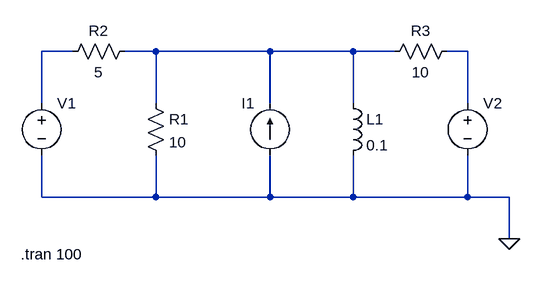
[diagram p0: schematic playdraf5.asc]
playdraf5.asc, the LTspice schematic file:
Version 4
SHEET 1 880 680
WIRE -80 96 -128 96
WIRE 48 96 0 96
WIRE 224 96 48 96
WIRE 352 96 224 96
WIRE 416 96 352 96
WIRE 528 96 496 96
WIRE -128 176 -128 96
WIRE 48 176 48 96
WIRE 224 176 224 96
WIRE 352 176 352 96
WIRE 528 176 528 96
WIRE -128 320 -128 256
WIRE 48 320 48 256
WIRE 48 320 -128 320
WIRE 224 320 224 256
WIRE 224 320 48 320
WIRE 352 320 352 256
WIRE 352 320 224 320
WIRE 528 320 528 256
WIRE 528 320 352 320
WIRE 592 320 528 320
WIRE 592 384 592 320
FLAG 592 384 0
SYMBOL ind 336 160 R0
SYMATTR InstName L1
SYMATTR Value 0.1
SYMBOL res 32 160 R0
SYMATTR InstName R1
SYMATTR Value 10
SYMBOL res 16 80 R90
WINDOW 0 0 56 VBottom 2
WINDOW 3 32 56 VTop 2
SYMATTR InstName R2
SYMATTR Value 5
SYMBOL res 512 80 R90
WINDOW 0 0 56 VBottom 2
WINDOW 3 32 56 VTop 2
SYMATTR InstName R3
SYMATTR Value 10
SYMBOL voltage -128 160 R0
WINDOW 3 24 96 Invisible 2
WINDOW 123 0 0 Left 0
WINDOW 39 0 0 Left 0
SYMATTR Value PULSE(0 1 20 1f 1f 200)
SYMATTR InstName V1
SYMBOL voltage 528 160 R0
WINDOW 3 24 96 Invisible 2
WINDOW 123 0 0 Left 0
WINDOW 39 0 0 Left 0
SYMATTR Value PULSE(0 2 20 1f 1f 200)
SYMATTR InstName V2
SYMBOL current 224 256 R180
WINDOW 0 24 80 Left 2
WINDOW 3 24 0 Invisible 2
WINDOW 123 0 0 Left 0
WINDOW 39 0 0 Left 0
SYMATTR InstName I1
SYMATTR Value PULSE(5 0 20 1f 1f 200)
TEXT -160 408 Left 2 !.tran 100

The netlist it stands for:
* playdraf5.asc
L1 N002 0 0.1
R1 N002 0 10
R2 N002 N001 5
R3 N003 N002 10
V1 N001 0 PULSE(0 1 20 1f 1f 200)
V2 N003 0 PULSE(0 2 20 1f 1f 200)
I1 0 N002 PULSE(5 0 20 1f 1f 200)
.tran 100
.backanno
.end